# EAGLE schematic Lab2 (EAGLE 7.6.0)

## Sheet 1 of 2
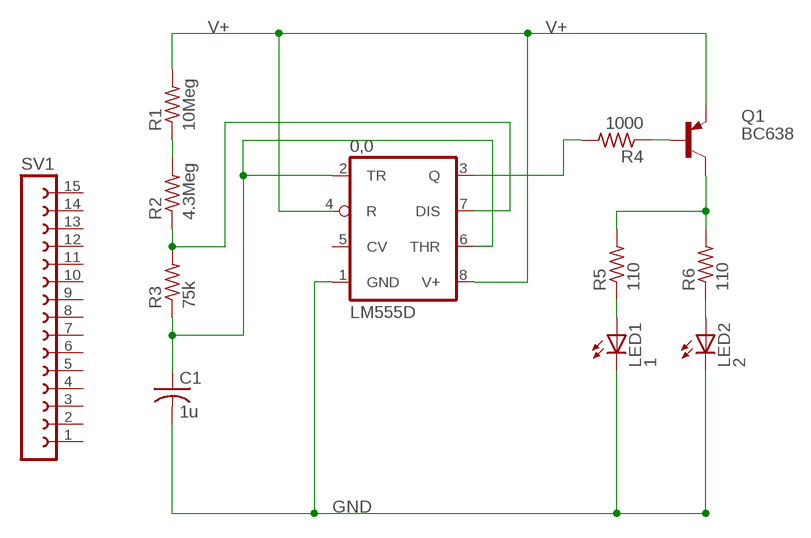
[diagram p0: schematic, sheet 1]

### Parts
0,0  LM555D  [SO08]
C1  1u  C-USC1206  [C1206]
LED1  1  LED3MM  [LED3MM]
LED2  2  LED3MM  [LED3MM]
Q1  BC638  [TO92-BCE]
R1  10Meg  R-US_M0805  [M0805]
R2  4.3Meg  R-US_M0805  [M0805]
R3  75k  R-US_M0805  [M0805]
R4  1000  R-US_M0805  [M0805]
R5  110  R-US_M0805  [M0805]
R6  110  R-US_M0805  [M0805]
SV1  FE15-1  [FE15]

### Nets
GND: 0,0.1(GND) C1.2 LED1.K(C) LED2.K(C) ; also sheet 2
N$2: R1.1 R2.2
N$3: 0,0.7(DIS) R2.1 R3.2
N$4: 0,0.2(TR) 0,0.6(THR) C1.1 R3.1
N$6: LED1.A R5.1
N$7: LED2.A R6.1
N$8: Q1.C R5.2 R6.2
N$9: Q1.B R4.1
N$10: 0,0.3(Q) R4.2
V+: 0,0.4(R) 0,0.8(V+) Q1.E R1.2 ; also sheet 2
Unconnected: 0,0.5(CV) SV1.1 SV1.2 SV1.3 SV1.4 SV1.5 SV1.6 SV1.7 SV1.8 SV1.9 SV1.10 SV1.11 SV1.12 SV1.13 SV1.14 SV1.15

## Sheet 2 of 2
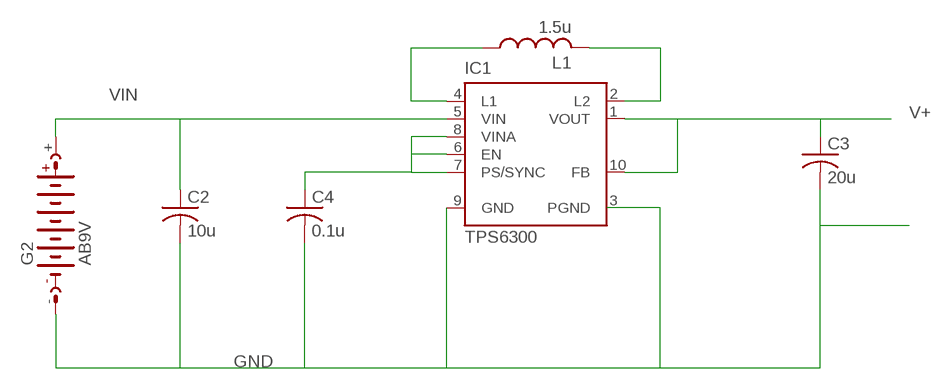
[diagram p1: schematic, sheet 2]

### Parts
C2  10u  C-USC1206  [C1206]
C3  20u  C-USC1206  [C1206]
C4  0.1u  C-USC1206  [C1206]
G2  AB9V  [AB9V]
IC1  TPS6300  [DRC-S-PVSON-N10]
L1  1.5u  L-USL4035M  [L4035M]

### Nets
GND: C2.2 C3.2 C4.2 G2.- IC1.9(GND) ; also sheet 1
N$11: IC1.4(L1) L1.1
N$12: IC1.2(L2) L1.2
N$14: C4.1 IC1.6(EN) IC1.7(PS/SYNC) IC1.8(VINA)
V+: C3.1 IC1.1(VOUT) IC1.10(FB) ; also sheet 1
VIN: C2.1 G2.+ IC1.5(VIN)
Unconnected: IC1.TH

## Power pins joined to a net without a drawn wire
PGND: IC1.3(PGND)

## Library data of the parts
0,0 = linear:*555: TIMER
C1-C4 = resistor:C-US: CAPACITOR, American symbol
G2 = battery:AB9V: 9-V BATTERY CLIP
IC1 = texas:TPS6300*: HIGH EFFICIENT SINGLE INDUCTOR BUCK-BOOST CONVERTER WITH 1.8-A SWITCHES Source: http://focus.ti.com/lit/ds/symlink/tps63001.pdf; MPN: TPS63000DRCTG4; OC_FARNELL: 1511852; OC_NEWARK: 59M7217
L1 = rcl:L-US: INDUCTOR, American symbol
LED1 LED2 = led:LED: LED OSRAM: - CHIPLED LG R971, LG N971, LY N971, LG Q971, LY Q971, LO R971, LY R971 LH N974, LH R974 LS Q976, LO Q976, LY Q976 LO Q996 - Hyper CHIPLED LW Q18S LB Q993, LB Q99A, LB R99A - SideLED LS A670, LO A670, LY A670, LG A670, LP A670 LB A673, LV A673, LT A673, LW A673 LH A674 LY A675 LS A676, LA A676, LO A676, LY A676, LW A676 LS A679, LY A679, LG A679 - Hyper Micro SIDELED® LS Y876, LA Y876, LO Y876, LY Y876 LT Y87S - SmartLED LW L88C, LW L88S LB L89C, LB L89S, LG L890 LS L89K, LO L89K, LY L89K LS L896, LA L896, LO L896, LY L896 - TOPLED LS T670, LO T670, LY T670, LG T670, LP T670 LSG T670, LSP T670, LSY T670, LOP T670, LYG T670 LG T671, LOG T671, LSG T671 LB T673, LV T673, LT T673, LW T673 LH T674 LS T676, LA T676, LO T676, LY T676, LB T676, LH T676, LSB T676, LW T676 LB T67C, LV T67C, LT T67C, LS T67K, LO T67K, LY T67K, LW E67C LS E67B, LA E67B, LO E67B, LY E67B, LB E67C, LV E67C, LT E67C LW T67C LS T679, LY T679, LG T679 LS T770, LO T770, LY T770, LG T770, LP T770 LB T773, LV T773, LT T773, LW T773 LH T774 LS E675, LA E675, LY E675, LS T675 LS T776, LA T776, LO T776, LY T776, LB T776 LHGB T686 LT T68C, LB T68C - Hyper Mini TOPLED® LB M676 - Mini TOPLED Santana® LG M470 LS M47K, LO M47K, LY M47K Source: http://www.osram.convergy.de LUXEON: - LUMILED® LXK2-PW12-R00, LXK2-PW12-S00, LXK2-PW14-U00, LXK2-PW14-V00 LXK2-PM12-R00, LXK2-PM12-S00, LXK2-PM14-U00 LXK2-PE12-Q00, LXK2-PE12-R00, LXK2-PE12-S00, LXK2-PE14-T00, LXK2-PE14-U00 LXK2-PB12-K00, LXK2-PB12-L00, LXK2-PB12-M00, LXK2-PB14-N00, LXK2-PB14-P00, LXK2-PB14-Q00 LXK2-PR12-L00, LXK2-PR12-M00, LXK2-PR14-Q00, LXK2-PR14-R00 LXK2-PD12-Q00, LXK2-PD12-R00, LXK2-PD12-S00 LXK2-PH12-R00, LXK2-PH12-S00 LXK2-PL12-P00, LXK2-PL12-Q00, LXK2-PL12-R00 Source: www.luxeon.com KINGBRIGHT: KA-3528ASYC Source: www.kingbright.com
Q1 = transistor-pnp:BC638*: PNP Transistror
R1-R6 = resistor:R-US_: RESISTOR, American symbol
SV1 = con-lsta:FE15-1: FEMALE HEADER; OC_FARNELL: unknown; OC_NEWARK: unknown